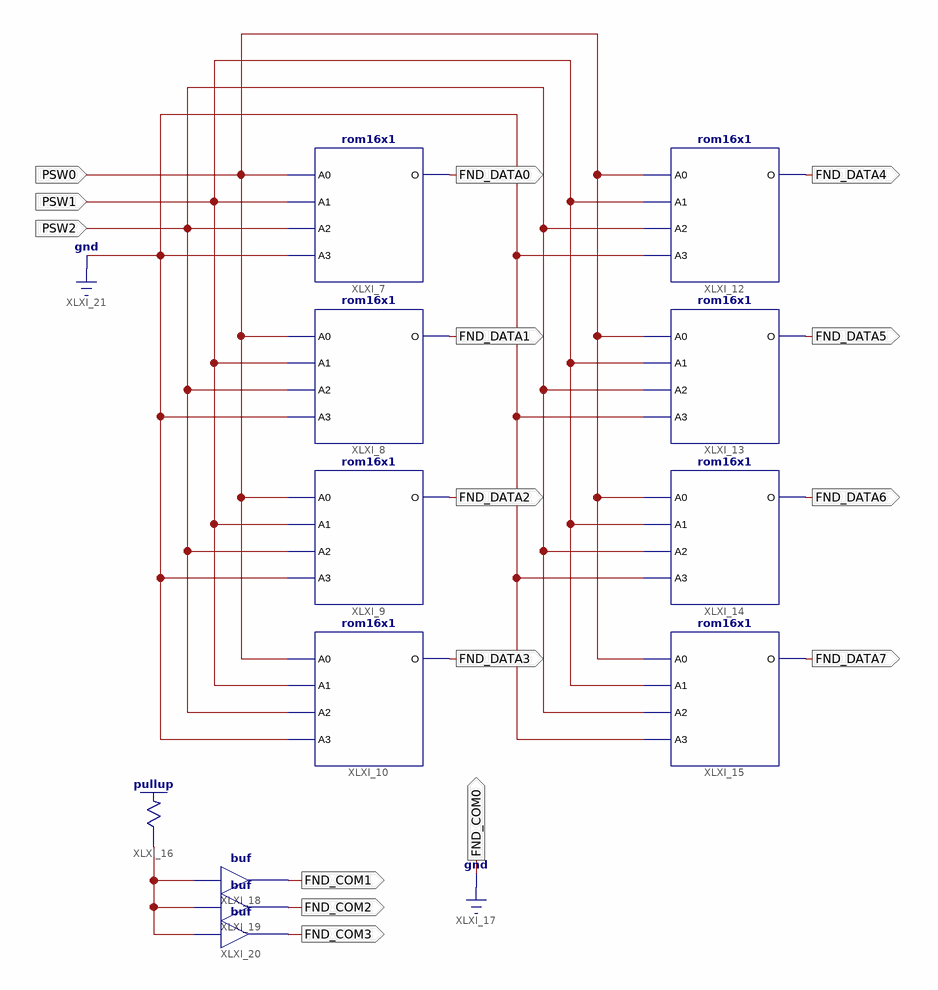
[diagram p0: schematic sheet 1]
// Xilinx ISE schematic lab9_rom2.sch (spartan3) as structural Verilog: 12 symbols, 15 ports
module lab9_rom2 (
  input  PSW0,
  input  PSW1,
  input  PSW2,
  output FND_DATA0,
  output FND_DATA1,
  output FND_DATA2,
  output FND_DATA3,
  output FND_DATA4,
  output FND_DATA5,
  output FND_DATA6,
  output FND_DATA7,
  output FND_COM1,
  output FND_COM2,
  output FND_COM3,
  output FND_COM0
);

  wire XLXN_44;

  rom16x1 #(.INIT("0032")) XLXI_7 (.A0(PSW0), .A1(PSW1), .A2(PSW2), .A3(1'b0), .O(FND_DATA0));
  rom16x1 #(.INIT("006E")) XLXI_8 (.A0(PSW0), .A1(PSW1), .A2(PSW2), .A3(1'b0), .O(FND_DATA1));
  rom16x1 #(.INIT("002E")) XLXI_9 (.A0(PSW0), .A1(PSW1), .A2(PSW2), .A3(1'b0), .O(FND_DATA2));
  rom16x1 #(.INIT("0052")) XLXI_10 (.A0(PSW0), .A1(PSW1), .A2(PSW2), .A3(1'b0), .O(FND_DATA3));
  rom16x1 #(.INIT("008E")) XLXI_12 (.A0(PSW0), .A1(PSW1), .A2(PSW2), .A3(1'b0), .O(FND_DATA4));
  rom16x1 #(.INIT("00CE")) XLXI_13 (.A0(PSW0), .A1(PSW1), .A2(PSW2), .A3(1'b0), .O(FND_DATA5));
  rom16x1 #(.INIT("0015")) XLXI_14 (.A0(PSW0), .A1(PSW1), .A2(PSW2), .A3(1'b0), .O(FND_DATA6));
  rom16x1 #(.INIT("00FF")) XLXI_15 (.A0(PSW0), .A1(PSW1), .A2(PSW2), .A3(1'b0), .O(FND_DATA7));
  \pullup  XLXI_16 (.O(XLXN_44));
  buf XLXI_18 (FND_COM1, XLXN_44);
  buf XLXI_19 (FND_COM2, XLXN_44);
  buf XLXI_20 (FND_COM3, XLXN_44);

  assign FND_COM0 = 1'b0;
endmodule
